# Altium schematic sheet Sheet1.SchDoc
size A4; SheetNumber: 1; SheetTotal: 3
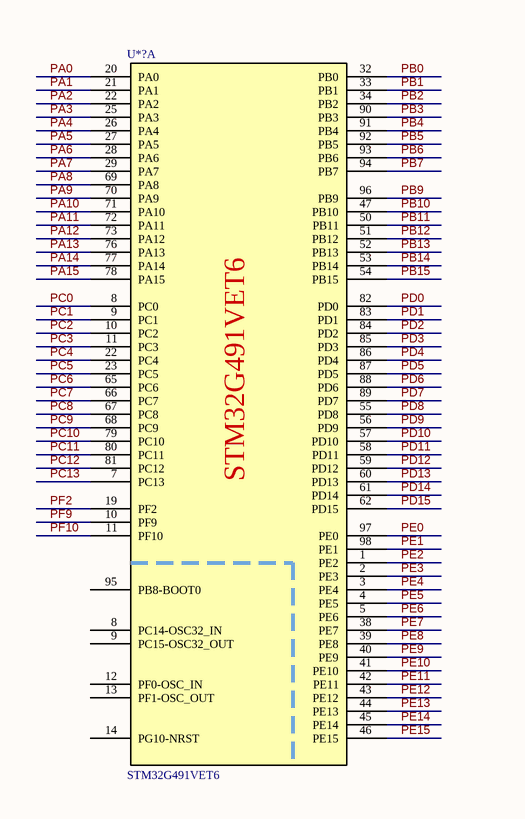
[diagram p0: Sheet1.SchDoc, left]
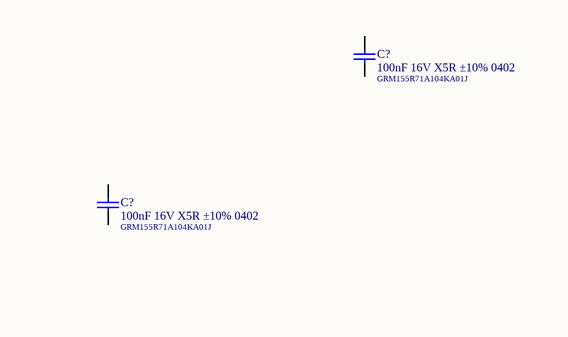
[diagram p1: Sheet1.SchDoc, right]

## Parts
(Parts that share a designator on the sheet are numbered #1, #2 ... from top to bottom, then left to right.)
C?#1  100nF 16V X5R ±10% 0402  Name: GRM155R71A104KA01J  [0402]
C?#2  100nF 16V X5R ±10% 0402  Name: GRM155R71A104KA01J  [0402]
U*?  STM32G491VET6  [QFP50P1600X1600X160-100N]  (part A of 2)

## Nets
PA0: U*?.20(PA0)
PA1: U*?.21(PA1)
PA2: U*?.22(PA2)
PA3: U*?.25(PA3)
PA4: U*?.26(PA4)
PA5: U*?.27(PA5)
PA6: U*?.28(PA6)
PA7: U*?.29(PA7)
PA8: U*?.69(PA8)
PA9: U*?.70(PA9)
PA10: U*?.71(PA10)
PA11: U*?.72(PA11)
PA12: U*?.73(PA12)
PA13: U*?.76(PA13)
PA14: U*?.77(PA14)
PA15: U*?.78(PA15)
PB0: U*?.32(PB0)
PB1: U*?.33(PB1)
PB2: U*?.34(PB2)
PB3: U*?.90(PB3)
PB4: U*?.91(PB4)
PB5: U*?.92(PB5)
PB6: U*?.93(PB6)
PB7: U*?.94(PB7)
PB9: U*?.96(PB9)
PB10: U*?.47(PB10)
PB11: U*?.50(PB11)
PB12: U*?.51(PB12)
PB13: U*?.52(PB13)
PB14: U*?.53(PB14)
PB15: U*?.54(PB15)
PC0: U*?.8(PC0)
PC1: U*?.9(PC1)
PC2: U*?.10(PC2)
PC3: U*?.11(PC3)
PC4: U*?.22(PC4)
PC5: U*?.23(PC5)
PC6: U*?.65(PC6)
PC7: U*?.66(PC7)
PC8: U*?.67(PC8)
PC9: U*?.68(PC9)
PC10: U*?.79(PC10)
PC11: U*?.80(PC11)
PC12: U*?.81(PC12)
PC13: U*?.7(PC13)
PD0: U*?.82(PD0)
PD1: U*?.83(PD1)
PD2: U*?.84(PD2)
PD3: U*?.85(PD3)
PD4: U*?.86(PD4)
PD5: U*?.87(PD5)
PD6: U*?.88(PD6)
PD7: U*?.89(PD7)
PD8: U*?.55(PD8)
PD9: U*?.56(PD9)
PD10: U*?.57(PD10)
PD11: U*?.58(PD11)
PD12: U*?.59(PD12)
PD13: U*?.60(PD13)
PD14: U*?.61(PD14)
PD15: U*?.62(PD15)
PE0: U*?.97(PE0)
PE1: U*?.98(PE1)
PE2: U*?.1(PE2)
PE3: U*?.2(PE3)
PE4: U*?.3(PE4)
PE5: U*?.4(PE5)
PE6: U*?.5(PE6)
PE7: U*?.38(PE7)
PE8: U*?.39(PE8)
PE9: U*?.40(PE9)
PE10: U*?.41(PE10)
PE11: U*?.42(PE11)
PE12: U*?.43(PE12)
PE13: U*?.44(PE13)
PE14: U*?.45(PE14)
PE15: U*?.46(PE15)
PF2: U*?.19(PF2)
PF9: U*?.10(PF9)
PF10: U*?.11(PF10)

Not connected (* = marked no-connect by the designer): C?#1 1 2; C?#2 1 2; U*? 12(PF0-OSC_IN) 13(PF1-OSC_OUT) 14(PG10-NRST) 95(PB8-BOOT0)

## Library data of the parts
C?#1 C?#2 = Capacitor ceramic: Ceramic capacitor; Manufacturer: Murata; Voltage: 16V; Tolerance: ±10%; Capacitance: 100nF; Dielectric: X5R; BOMString: =Capacitance+' '+Voltage+' '+Tolerance+' '+Footprint; HelpURL: *; Supplier: *